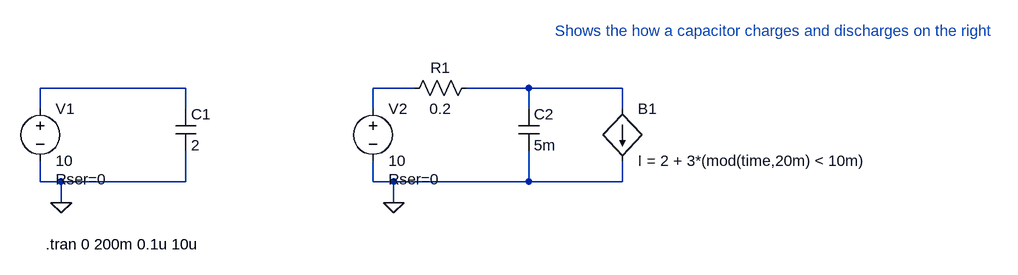
[diagram p0: schematic Capacitor_test.asc]
Capacitor_test.asc, the LTspice schematic file:
Version 4.1
SHEET 1 1648 680
WIRE 288 80 64 80
WIRE 640 80 576 80
WIRE 816 80 720 80
WIRE 960 80 816 80
WIRE 64 112 64 80
WIRE 288 112 288 80
WIRE 576 112 576 80
WIRE 816 112 816 80
WIRE 960 112 960 80
WIRE 64 224 64 192
WIRE 96 224 64 224
WIRE 288 224 288 176
WIRE 288 224 96 224
WIRE 576 224 576 192
WIRE 608 224 576 224
WIRE 816 224 816 176
WIRE 816 224 608 224
WIRE 960 224 960 192
WIRE 960 224 816 224
WIRE 96 256 96 224
WIRE 608 256 608 224
FLAG 96 256 0
FLAG 608 256 0
SYMBOL voltage 64 96 R0
WINDOW 123 0 0 Left 0
WINDOW 39 24 124 Left 2
SYMATTR SpiceLine Rser=0
SYMATTR InstName V1
SYMATTR Value 10
SYMBOL cap 272 112 R0
SYMATTR InstName C1
SYMATTR Value 2
SYMATTR SpiceLine Rser=1 Rpar=1T
SYMBOL voltage 576 96 R0
WINDOW 123 0 0 Left 0
WINDOW 39 24 124 Left 2
SYMATTR SpiceLine Rser=0
SYMATTR InstName V2
SYMATTR Value 10
SYMBOL cap 800 112 R0
SYMATTR InstName C2
SYMATTR Value 5m
SYMATTR SpiceLine Rser=0.2 Rpar=1T Cpar=100n
SYMBOL bi 960 112 R0
SYMATTR InstName B1
SYMATTR Value I = 2 + 3*(mod(time,20m) < 10m)
SYMBOL res 736 64 R90
WINDOW 0 0 56 VBottom 2
WINDOW 3 32 56 VTop 2
SYMATTR InstName R1
SYMATTR Value 0.2
TEXT 72 320 Left 2 !.tran 0 200m 0.1u 10u
TEXT 856 -8 Left 2 ;Shows the how a capacitor charges and discharges on the right

The netlist it stands for:
* Capacitor_test.asc
V1 N001 0 10 Rser=0
C1 N001 0 2 Rser=1 Rpar=1T
V2 N002 0 10 Rser=0
C2 N003 0 5m Rser=0.2 Rpar=1T Cpar=100n
B1 N003 0 I = 2 + 3*(mod(time,20m) < 10m)
R1 N003 N002 0.2
.tran 0 200m 0.1u 10u
* Shows the how a capacitor charges and discharges on the right
.backanno
.end